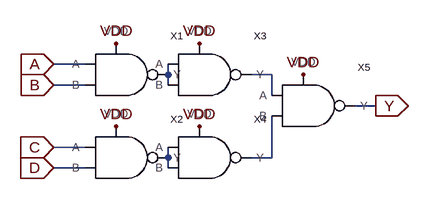
[diagram p0: schematic and4.asc]
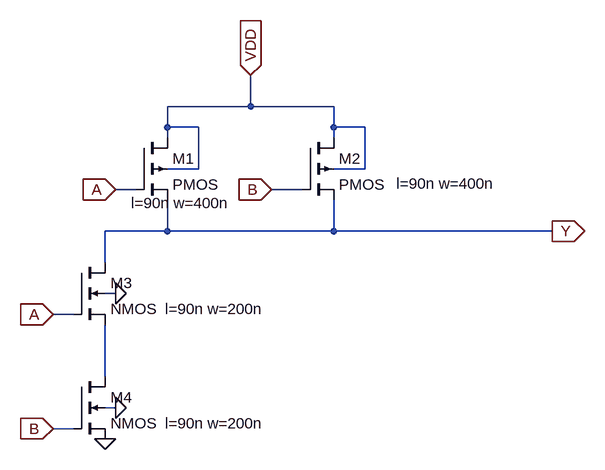
[diagram p1: sub-circuit nand.asc]
and4.asc, the LTspice schematic file:
Version 4
SHEET 1 880 680
WIRE 48 80 0 80
WIRE 176 96 176 80
WIRE 336 96 304 96
WIRE 48 112 0 112
WIRE 176 112 176 96
WIRE 336 128 336 96
WIRE 496 144 464 144
WIRE 48 208 0 208
WIRE 176 224 176 208
WIRE 336 224 336 160
WIRE 336 224 304 224
WIRE 48 240 0 240
WIRE 176 240 176 224
FLAG 0 80 A
IOPIN 0 80 In
FLAG 0 112 B
IOPIN 0 112 In
FLAG 0 208 C
IOPIN 0 208 In
FLAG 0 240 D
IOPIN 0 240 In
FLAG 496 144 Y
IOPIN 496 144 Out
FLAG 384 96 VDD
FLAG 224 48 VDD
FLAG 224 176 VDD
FLAG 96 48 VDD
FLAG 96 176 VDD
SYMBOL nand 96 96 R0
SYMATTR InstName X1
SYMBOL nand 96 224 R0
SYMATTR InstName X2
SYMBOL nand 224 96 R0
SYMATTR InstName X3
SYMBOL nand 224 224 R0
SYMATTR InstName X4
SYMBOL nand 384 144 R0
SYMATTR InstName X5

nand.asc, the sub-circuit schematic file:
Version 4
SHEET 1 1436 680
WIRE 896 -896 896 -944
WIRE 896 -896 768 -896
WIRE 1024 -896 896 -896
WIRE 768 -864 768 -896
WIRE 816 -864 768 -864
WIRE 1024 -864 1024 -896
WIRE 1072 -864 1024 -864
WIRE 768 -848 768 -864
WIRE 1024 -848 1024 -864
WIRE 816 -800 816 -864
WIRE 816 -800 768 -800
WIRE 1072 -800 1072 -864
WIRE 1072 -800 1024 -800
WIRE 720 -768 688 -768
WIRE 976 -768 928 -768
WIRE 768 -704 768 -752
WIRE 768 -704 672 -704
WIRE 1024 -704 1024 -752
WIRE 1024 -704 768 -704
WIRE 1360 -704 1024 -704
WIRE 672 -656 672 -704
WIRE 688 -608 672 -608
WIRE 624 -576 592 -576
WIRE 672 -480 672 -560
WIRE 688 -432 672 -432
WIRE 624 -400 592 -400
FLAG 688 -768 A
IOPIN 688 -768 In
FLAG 592 -576 A
IOPIN 592 -576 In
FLAG 1360 -704 Y
IOPIN 1360 -704 Out
FLAG 896 -944 VDD
IOPIN 896 -944 In
FLAG 928 -768 B
IOPIN 928 -768 In
FLAG 592 -400 B
IOPIN 592 -400 In
FLAG 688 -608 0
FLAG 688 -432 0
FLAG 672 -384 0
SYMBOL pmos4 720 -848 R0
WINDOW 123 -8 101 Left 2
SYMATTR InstName M1
SYMATTR Value2 l=90n w=400n
SYMBOL pmos4 976 -848 R0
WINDOW 123 144 71 Left 2
SYMATTR InstName M2
SYMATTR Value2 l=90n w=400n
SYMBOL nmos4 624 -656 R0
WINDOW 123 140 72 Left 2
SYMATTR InstName M3
SYMATTR Value2 l=90n w=200n
SYMBOL nmos4 624 -480 R0
WINDOW 123 140 72 Left 2
SYMATTR InstName M4
SYMATTR Value2 l=90n w=200n

The netlist it stands for:
* and4.asc
XX1 A B VDD N001 nand
XX2 C D VDD N003 nand
XX3 N001 N001 VDD N002 nand
XX4 N003 N003 VDD N004 nand
XX5 N002 N004 VDD Y nand

* block symbol definitions
.subckt nand A B VDD Y
M1 VDD A Y VDD PMOS l=90n w=400n
M2 VDD B Y VDD PMOS l=90n w=400n
M3 Y A N001 0 NMOS l=90n w=200n
M4 N001 B 0 0 NMOS l=90n w=200n
.ends nand

.model NMOS NMOS
.model PMOS PMOS
.lib standard.mos
.backanno
.end